# EAGLE design MotorProRePro (EAGLE 9.5.0)
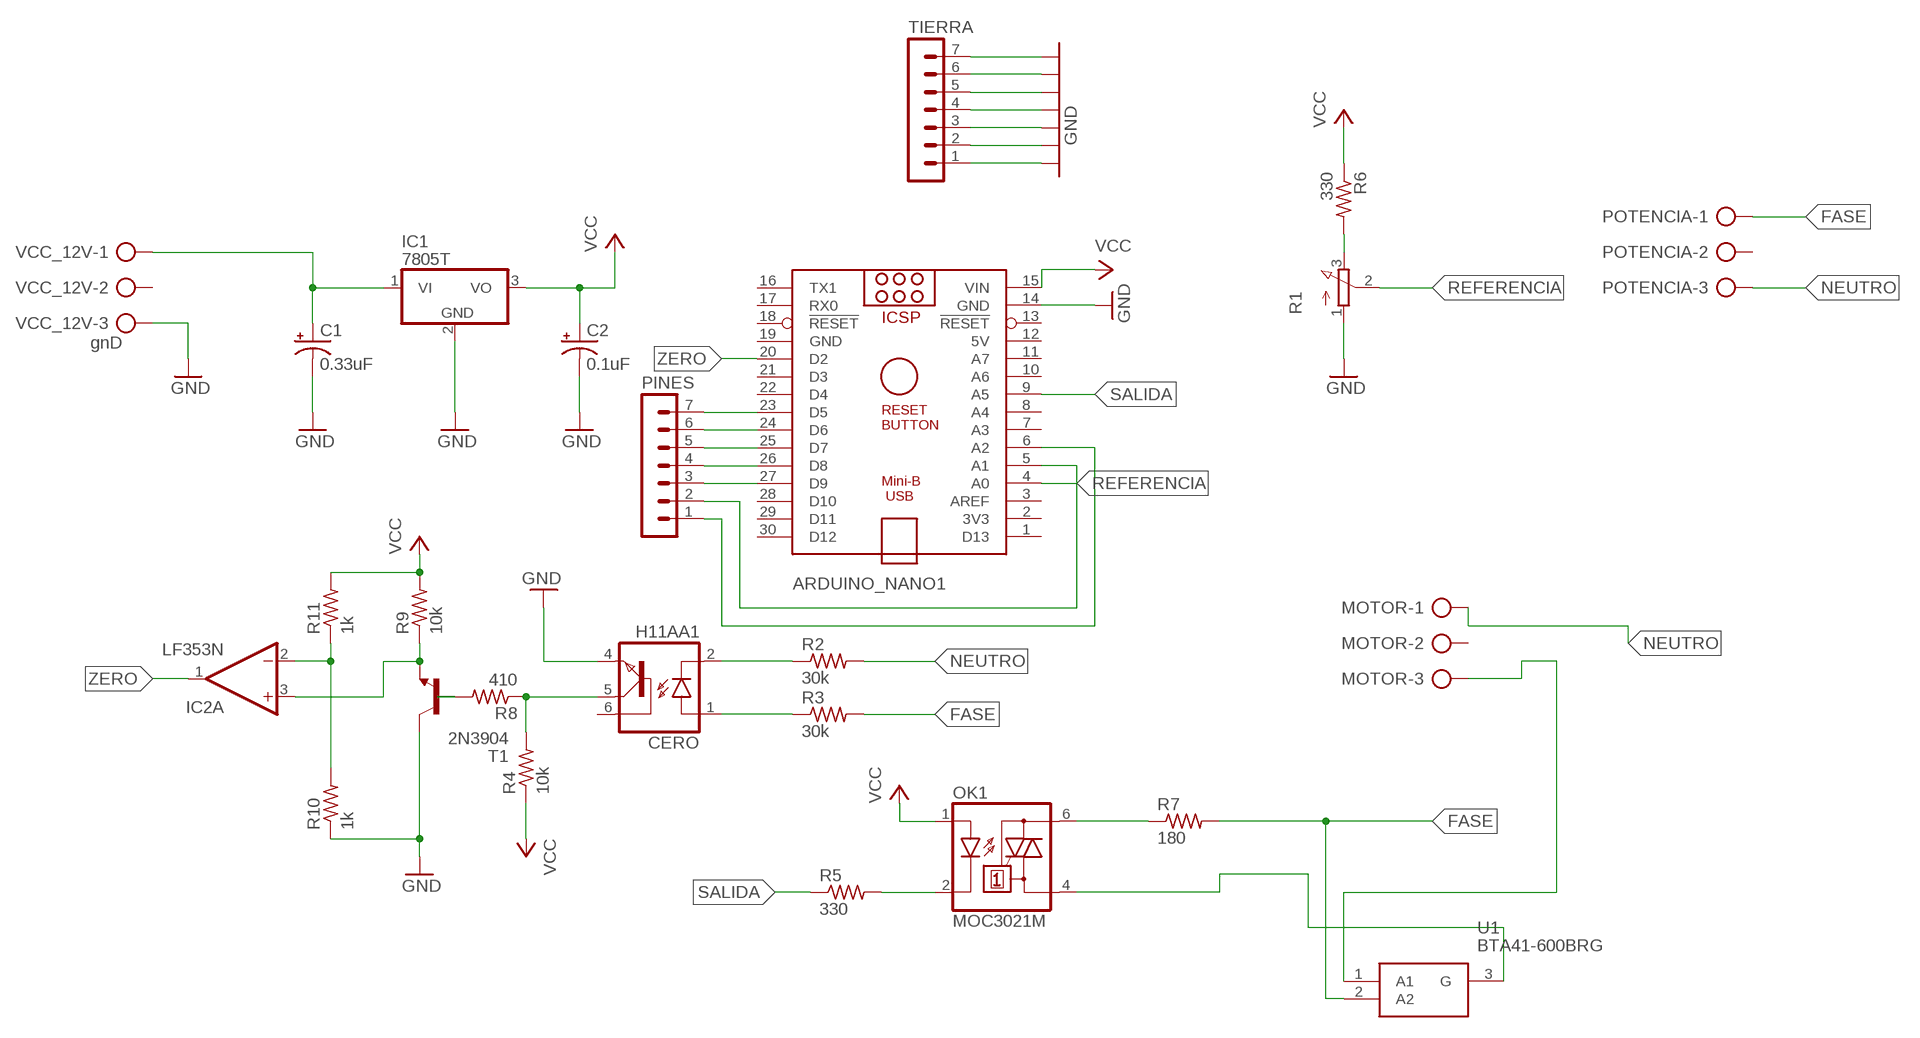
[diagram p0: schematic, sheet 1]

## Parts
ARDUINO_NANO1  ARDUINO_NANO  [ARDUINO_NANO]
C1  0.33uF  CPOL-USE5-6  [E5-6]
C2  0.1uF  CPOL-USE5-6  [E5-6]
CERO  H11AA1  H11A1M  [DIL06]
IC1  7805T  [TO220H]
IC2  LF353N  [DIL08]
MOTOR  AK500/3-H  [AK500/3-H]
OK1  MOC3021M  [DIL06]
PINES  MA07-1  [MA07-1]
POTENCIA  AK500/3-H  [AK500/3-H]
R1  3RP/1610N  [3RP/1610N]
R2  30k  R-US_0207/10  [0207/10]
R3  30k  R-US_0207/10  [0207/10]
R4  10k  R-US_0207/10  [0207/10]
R5  330  R-US_0207/10  [0207/10]
R6  330  R-US_0207/10  [0207/10]
R7  180  R-US_0207/10  [0207/10]
R8  410  R-US_0207/10  [0207/10]
R9  10k  R-US_0207/10  [0207/10]
R10  1k  R-US_0207/10  [0207/10]
R11  1k  R-US_0207/10  [0207/10]
T1  2N3904  [TO92]
TIERRA  MA07-1  [MA07-1]
U1  BTA41-600BRG  [TO552P460X1530X2985-3P]
VCC_12V  gnD  AK500/3-H  [AK500/3-H]

## Nets
FASE: POTENCIA.1 R3.2 R7.2 U1.2(A2)
GND: ARDUINO_NANO1.14(GND) C1.- C2.- CERO.4(EMI) IC1.2(GND) R1.1(A) R10.1 T1.1(C) TIERRA.1 TIERRA.2 TIERRA.3 TIERRA.4 TIERRA.5 TIERRA.6 TIERRA.7 VCC_12V.3
N$1: C1.+ IC1.1(VI) VCC_12V.1
N$2: CERO.2(C) R2.1
N$3: CERO.1(A) R3.1
N$4: OK1.2(C) R5.2
N$5: R1.3(E) R6.2
N$6: OK1.6(A2) R7.1
N$7: MOTOR.3 U1.1(A1)
N$8: OK1.4(A1) U1.3(G)
N$9: ARDUINO_NANO1.23(D5) PINES.7
N$10: ARDUINO_NANO1.24(D6) PINES.6
N$11: ARDUINO_NANO1.25(D7) PINES.5
N$12: ARDUINO_NANO1.26(D8) PINES.4
N$13: ARDUINO_NANO1.27(D9) PINES.3
N$14: ARDUINO_NANO1.5(A1) PINES.2
N$15: ARDUINO_NANO1.6(A2) PINES.1
N$16: R8.2 T1.2(B)
N$17: IC2.3(A:+IN) R9.1 T1.3(E)
N$18: IC2.2(A:-IN) R10.2 R11.1
NEUTRO: MOTOR.1 POTENCIA.3 R2.2
REFERENCIA: ARDUINO_NANO1.4(A0) R1.2(S)
SALIDA: ARDUINO_NANO1.9(A5) R5.1
VCC: ARDUINO_NANO1.15(VIN) C2.+ IC1.3(VO) OK1.1(A) R4.1 R6.1 R9.2 R11.2
ZERO: ARDUINO_NANO1.20(D2) CERO.5(COL) IC2.1(A:OUT) R4.2 R8.1
Unconnected: ARDUINO_NANO1.1(D13) ARDUINO_NANO1.2(3V3) ARDUINO_NANO1.3(AREF) ARDUINO_NANO1.7(A3) ARDUINO_NANO1.8(A4) ARDUINO_NANO1.10(A6) ARDUINO_NANO1.11(A7) ARDUINO_NANO1.13(!RESET) ARDUINO_NANO1.16(TX1) ARDUINO_NANO1.17(RX0) ARDUINO_NANO1.18(!RESET) ARDUINO_NANO1.21(D3) ARDUINO_NANO1.22(D4) ARDUINO_NANO1.28(D10) ARDUINO_NANO1.29(D11) ARDUINO_NANO1.30(D12) CERO.6(BAS) IC2.5(B:+IN) IC2.6(B:-IN) IC2.7(B:OUT) MOTOR.2 POTENCIA.2 VCC_12V.2

## Power pins joined to a net without a drawn wire
5V: ARDUINO_NANO1.12(5V)
GND: ARDUINO_NANO1.19(GND)
V+: IC2.8(P:V+)
V-: IC2.4(P:V-)

## Library data of the parts
ARDUINO_NANO1 = ArduinoNanoV30:ARDUINO_NANO: Arduino Nano V3.0 Overview: The Arduino Nano is a small, complete, and breadboard-friendly board based on the ATmega328 (Arduino Nano 3.x) or ATmega168 (Arduino Nano 2.x). It has more or less the same functionality of the Arduino Duemilanove, but in a different package. It lacks only a DC power jack, and works with a Mini-B USB cable instead of a standard one. The Nano was designed and is being produced by Gravitech. Specifications: Microcontroller Atmel ATmega168 or ATmega328 Operating Voltage (logic level) 5 V Input Voltage (recommended) 7-12 V Input Voltage (limits) 6-20 V Digital I/O Pins 14 (of which 6 provide PWM output) Analog Input Pins 8 DC Current per I/O Pin 40 mA Flash Memory 16 KB (ATmega168) or 32 KB (ATmega328) of which 2 KB used by bootloader SRAM 1 KB (ATmega168) or 2 KB (ATmega328) EEPROM 512 bytes (ATmega168) or 1 KB (ATmega328) Clock Speed 16 MHz Dimensions 0.73" x 1.70" Length 45 mm Width 18 mm Weigth 5 g Power: The Arduino Nano can be powered via the Mini-B USB connection, 6-20V unregulated external power supply (pin 30), or 5V regulated external power supply (pin 27). The power source is automatically selected to the highest voltage source. Memory: The ATmega168 has 16 KB of flash memory for storing code (of which 2 KB is used for the bootloader); the ATmega328 has 32 KB, (also with 2 KB used for the bootloader). The ATmega168 has 1 KB of SRAM and 512 bytes of EEPROM (which can be read and written with the EEPROM library); the ATmega328 has 2 KB of SRAM and 1 KB of EEPROM. Input and Output: Each of the 14 digital pins on the Nano can be used as an input or output, using pinMode(), digitalWrite(), and digitalRead() functions. They operate at 5 volts. Each pin can provide or receive a maximum of 40 mA and has an internal pull-up resistor (disconnected by default) of 20-50 kOhms. In addition, some pins have specialized functions. Visit Arduino - ArduinoBoardNano <https://www.arduino.cc/en/Main/ArduinoBoardNano>
C1 C2 = rcl:CPOL-US: POLARIZED CAPACITOR, American symbol; SPICEPREFIX: C
CERO = optocoupler:H11A*?M: General Purpose 6-Pin Phototransistor Optocouplers Source: http://www.fairchildsemi.com/ds/4N/4N35-M.pdf; MPN: H11A1-M; OC_FARNELL: 1021358; OC_NEWARK: 97K1793
IC1 = linear:78*: Positive VOLTAGE REGULATOR Source: http://cache.national.com/ds/LM/LM78L05.pdf http://www.fairchildsemi.com/ds/LM/LM7805.pdf
IC2 = linear:LF353: OP AMP
MOTOR POTENCIA VCC_12V = con-ptr500:AK500/3-H: CONNECTOR Aug. 2004 / PTR Meßtechnik: Die Bezeichnung der Serie AK505 wurde geändert. Es handelt sich hierbei um AK500 in horizontaler Ausführung.; OC_FARNELL: unknown; OC_NEWARK: unknown
OK1 = optocoupler:MOC30*M: RANDOM-PHASE OPTOISOLATORS TRIAC DRIVER OUTPUT Source: http://www.fairchildsemi.com MOC3020-M.pdf; MF: FAIRCHILD SEMICONDUCTOR; MPN: MOC3021-M; OC_FARNELL: 1021365; OC_NEWARK: 95B7895
PINES TIERRA = con-lstb:MA07-1: PIN HEADER; OC_FARNELL: unknown; OC_NEWARK: unknown
R1 = pot:3RP/1610N: 16mm Potentiometer one level Source: http://www.alphapotentiometers.net/html/16mm_pot_2.html
R2-R11 = rcl:R-US_: RESISTOR, American symbol; SPICEPREFIX: R
T1 = transistor:2N3904: NPN TRANSISTOR
U1 = BTA41-600BRG:BTA41-600BRG: TRIAC BTA41-600BRG, 600V, Gate Trigger 1.3V 100mA, TOP Insulated 3-Pin Source: Datasheet <http://uk.rs-online.com/web/p/products/6871007P>; ALLIED_NUMBER: 70332160; DESCRIPTION: TRIAC BTA41-600BRG, 600V, Gate Trigger 1.3V 100mA, TOP Insulated 3-Pin; HEIGHT: 4.6mm; MANUFACTURER_NAME: STMicroelectronics; MANUFACTURER_PART_NUMBER: BTA41-600BRG; RS_PART_NUMBER: 6871007P; RS_PRICE-STOCK: http://uk.rs-online.com/web/p/products/6871007P

## Board
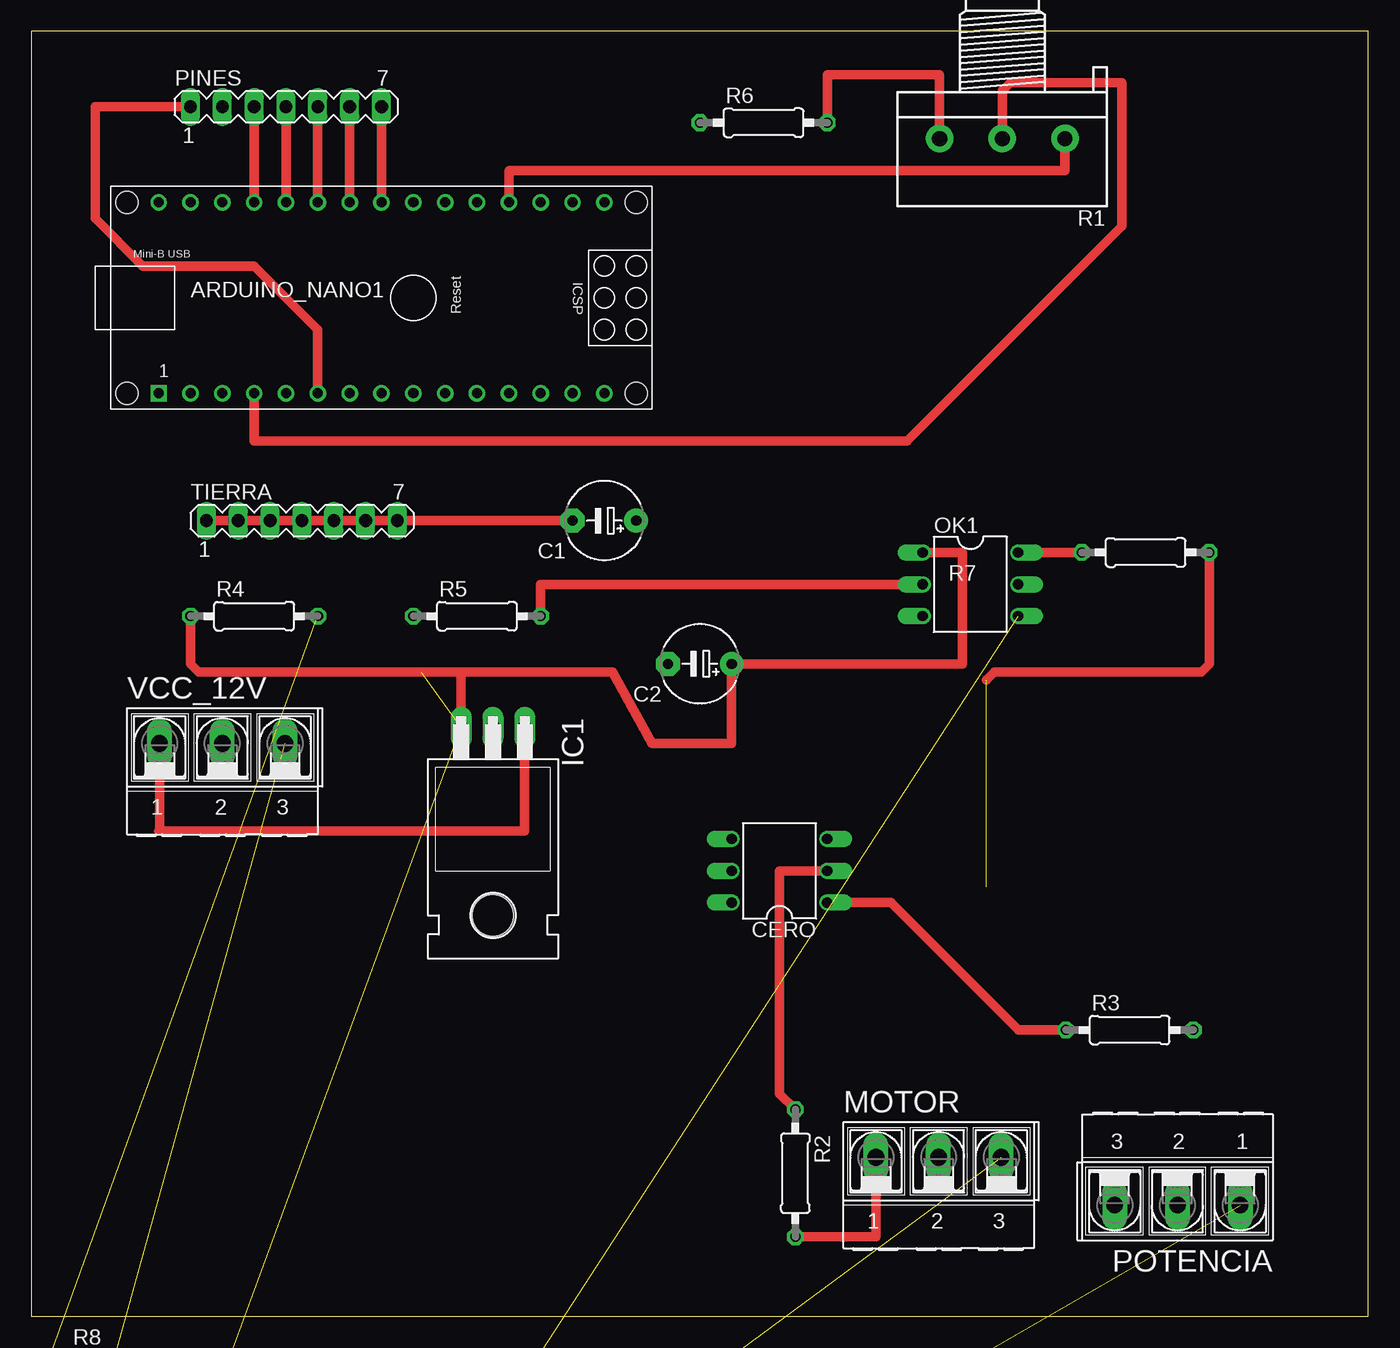
[diagram p1: board, top side]
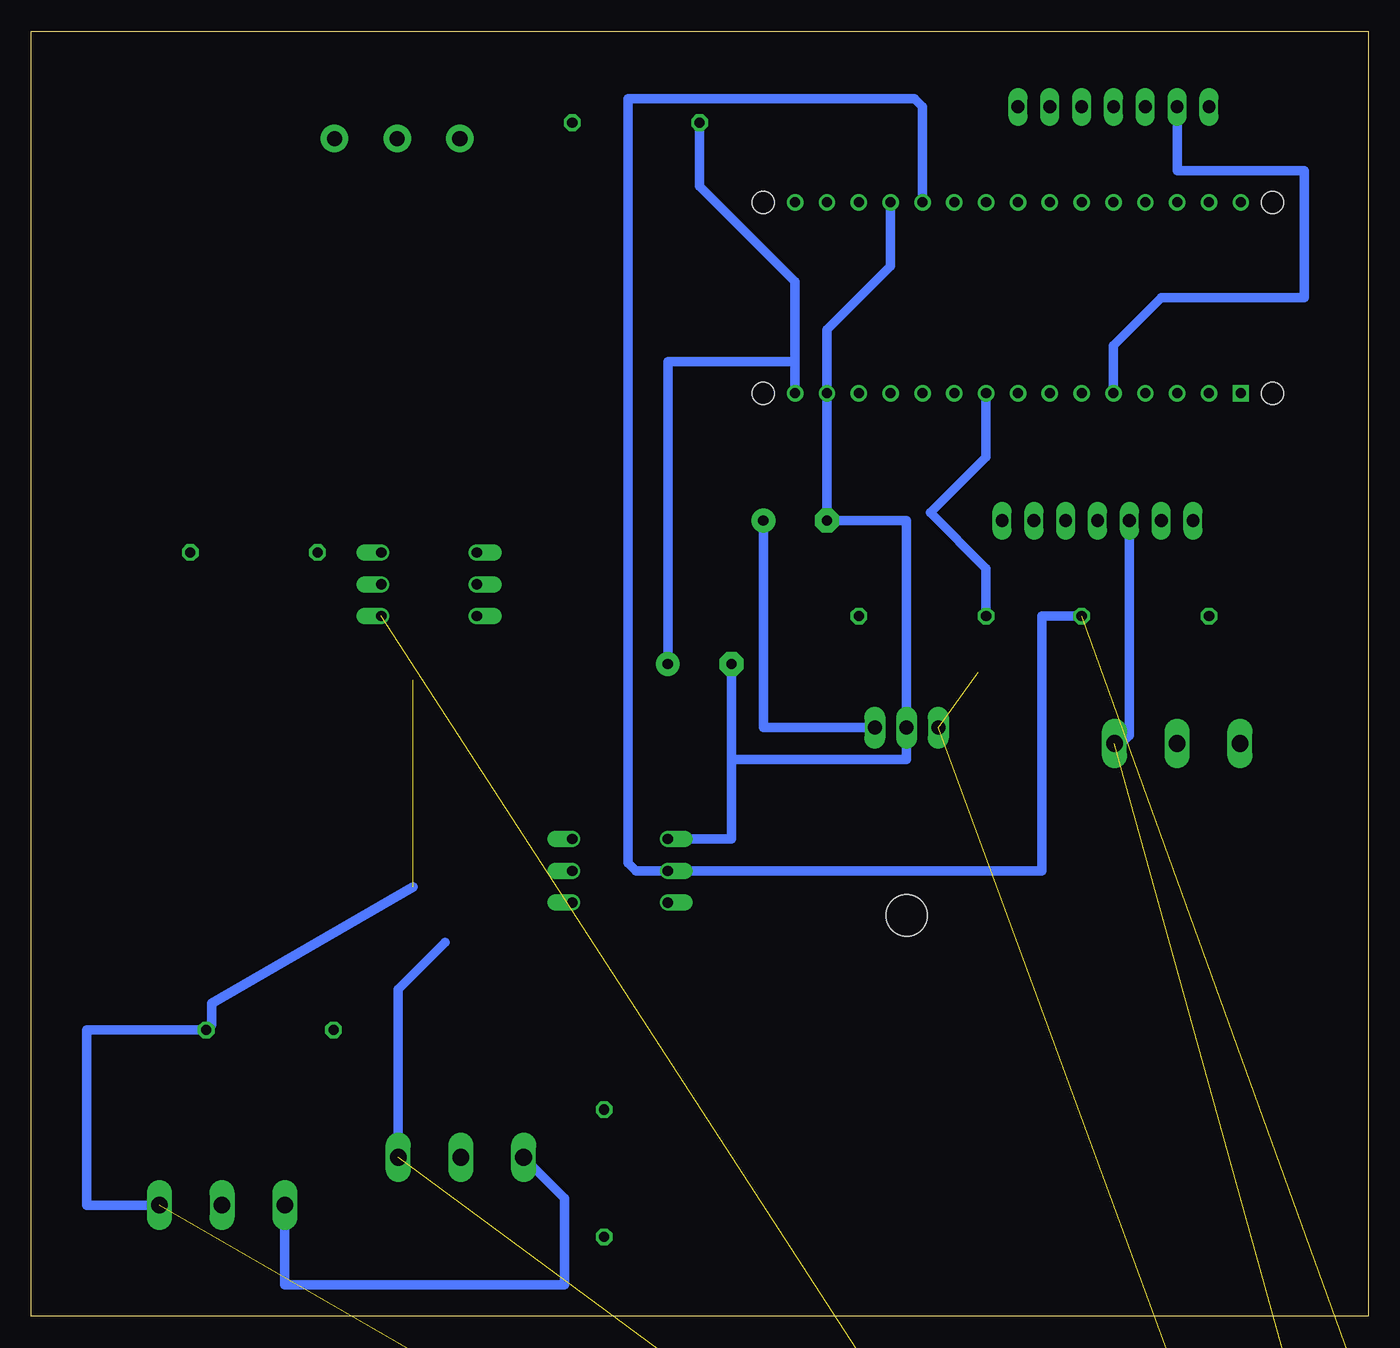
[diagram p2: board, bottom side, seen from below]

Size 106.66 x 102.54 mm. Coordinates in mm from the lower left corner, seen from the top.
Outline: 0,0 106.66,0 106.66,102.54 0,102.54 0,0
Copper layers (1*16): Top 0.035mm / dielectric 1.5mm / Bottom 0.035mm
Design rules "default *": minimum track width 30mil, minimum drill 0.35mm, track to track 15mil, track to pad 10mil, pad to pad 10mil, via to via 10mil, smd to smd 10mil, copper to edge 40mil, drill to drill 6mil, minimum pad ring 10mil, minimum via ring 8mil, stop-mask expansion 4mil, vias tented up to drill 0mil, thermal gap 10mil

### Footprints (pad centres in the part's own frame; a part is rotated, then mirrored left to right if it is on the bottom)
ARDUINO_NANO = drill 0.8 square: 1 -20.32,-7.62 | drill 0.8: 2 -17.78,-7.62; 3 -15.24,-7.62; 4 -12.7,-7.62; 5 -10.16,-7.62; 6 -7.62,-7.62; 7 -5.08,-7.62; 8 -2.54,-7.62; 9 0,-7.62; 10 2.54,-7.62; 11 5.08,-7.62; 12 7.62,-7.62; 13 10.16,-7.62; 14 12.7,-7.62; 15 15.24,-7.62; 16 15.24,7.62; 17 12.7,7.62; 18 10.16,7.62; 19 7.62,7.62; 20 5.08,7.62; 21 2.54,7.62; 22 0,7.62; 23 -2.54,7.62; 24 -5.08,7.62; 25 -7.62,7.62; 26 -10.16,7.62; 27 -12.7,7.62; 28 -15.24,7.62; 29 -17.78,7.62; 30 -20.32,7.62 | hole 1.778: -22.86,-7.62; -22.86,7.62; 17.78,7.62; 17.78,-7.62
E5-6 = drill 0.813 pad 1.905: + -2.54,0 | drill 0.813 pad 1.905 octagon: - 2.54,0
DIL06 = drill 0.813 offset: 1 -2.54,-3.81; 2 0,-3.81; 3 2.54,-3.81; 4 2.54,3.81; 5 0,3.81; 6 -2.54,3.81
TO220H = drill 1.118 long: 1 -2.54,-10.16; 2 0,-10.16; 3 2.54,-10.16 | hole 3.302: 0,4.826
DIL08 = drill 0.813 pad 1.27: 1 -3.81,-3.81; 2 -1.27,-3.81; 3 1.27,-3.81; 4 3.81,-3.81; 5 3.81,3.81; 6 1.27,3.81; 7 -1.27,3.81; 8 -3.81,3.81
AK500/3-H = drill 1.321 long: 1 -5.004,0; 2 0,0; 3 5.004,0
MA07-1 = drill 1.016 long: 1 -7.62,0; 2 -5.08,0; 3 -2.54,0; 4 0,0; 5 2.54,0; 6 5.08,0; 7 7.62,0
3RP/1610N = drill 1.2 pad 2.184: 1 -5,0; 2 0,0; 3 5,0
0207/10 = drill 0.813 octagon: 1 -5.08,0; 2 5.08,0
TO92 = drill 0.813 octagon: 1 1.27,0; 2 0,1.905; 3 -1.27,0
TO552P460X1530X2985-3P = drill 1.77 pad 2.655 square: 1 0,0 | drill 1.77 pad 2.655: 2 5.525,0; 3 11.05,0

### Placement (x,y rotation side)
ARDUINO_NANO1  30.48,81.28 0 top
C1  45.72,63.5 180 top
C2  53.34,52.07 180 top
CERO  59.69,35.56 90 top
IC1  36.83,36.83 180 top
IC2  7.62,-21.59 0 top  (outside the outline)
MOTOR  72.39,12.7 0 top
OK1  74.93,58.42 270 top
PINES  20.32,96.52 0 top
POTENCIA  91.44,8.89 180 top
R1  77.47,93.98 180 top
R2  60.96,11.43 270 top
R3  87.63,22.86 0 top
R4  17.78,55.88 0 top
R5  35.56,55.88 0 top
R6  58.42,95.25 0 top
R7  88.9,60.96 0 top
R8  6.35,-3.81 0 top  (outside the outline)
R9  6.35,-15.24 0 top  (outside the outline)
R10  6.35,-30.48 0 top  (outside the outline)
R11  6.35,-35.56 0 top  (outside the outline)
T1  3.81,-8.89 0 top  (outside the outline)
TIERRA  21.59,63.5 0 top
U1  5.08,-40.64 0 top  (outside the outline)
VCC_12V  15.24,45.72 0 top

### Tracks (layer width: path | path; a pad name or v marks a point on that pad's centre or on a via)
FASE  (2 unrouted)
  Top 0.762: R7.2 93.98,52.07 93.35,51.44 76.84,51.44 76.2,50.8
  Bottom 0.762: POTENCIA.1 102.23,8.89 102.23,22.86 R3.2 92.29,23.28 92.29,24.98 76.2,34.29
GND  (2 unrouted)
  Top 0.762: TIERRA.1 TIERRA.2 TIERRA.3 TIERRA.4 TIERRA.5 TIERRA.6 TIERRA.7 C1.- | R1.1 82.47,91.44 38.1,91.44 ARDUINO_NANO1.19
  Bottom 0.762: TIERRA.3 19.05,46.35 19.68,45.72 VCC_12V.3 | CERO.4 50.8,38.1 50.8,44.45 | C2.- 50.8,44.45 | ARDUINO_NANO1.19 38.1,83.82 43.18,78.74 ARDUINO_NANO1.14 C1.- 36.83,63.5 IC1.2 36.83,44.45 50.8,44.45
N$1
  Top 0.762: VCC_12V.1 10.24,38.81 10.16,38.73 39.37,38.73 IC1.1
  Bottom 0.762: IC1.1 48.26,46.99 C1.+
N$2
  Top 0.762: R2.1 59.69,17.78 59.69,35.56 CERO.2
N$3
  Top 0.762: CERO.1 68.58,33.02 78.74,22.86 R3.1
N$4
  Top 0.762: R5.2 40.64,58.42 OK1.2
N$5
  Top 0.762: R6.2 63.5,99.06 72.47,99.06 R1.3
N$6
  Top 0.762: R7.1 OK1.6
N$7  (1 unrouted)
  Bottom 0.762: MOTOR.3 77.39,26.11 73.66,29.84
N$8  (1 unrouted)
N$9
  Top 0.762: PINES.7 ARDUINO_NANO1.23
N$10
  Top 0.762: PINES.6 ARDUINO_NANO1.24
N$11
  Top 0.762: PINES.5 ARDUINO_NANO1.25
N$12
  Top 0.762: PINES.4 ARDUINO_NANO1.26
N$13
  Top 0.762: PINES.3 ARDUINO_NANO1.27
N$14
  Bottom 0.762: ARDUINO_NANO1.5 20.32,77.47 16.51,81.28 5.08,81.28 5.08,91.44 15.24,91.44 PINES.2
N$15
  Top 0.762: ARDUINO_NANO1.6 22.86,78.74 17.78,83.82 8.89,83.82 5.08,87.63 5.08,96.52 PINES.1
N$16  (1 unrouted)
N$17  (2 unrouted)
N$18  (2 unrouted)
NEUTRO
  Top 0.762: MOTOR.1 67.39,6.35 R2.2
  Bottom 0.762: POTENCIA.3 86.44,2.54 64.14,2.54 64.14,9.45 MOTOR.1
REFERENCIA
  Top 0.762: ARDUINO_NANO1.4 17.78,69.85 69.85,69.85 87,87 87,98.43 78.11,98.43 77.47,97.79 R1.2
SALIDA
  Bottom 0.762: ARDUINO_NANO1.9 30.48,68.58 34.92,64.14 30.48,59.69 R5.1
VCC  (3 unrouted)
  Top 0.762: OK1.1 74.3,60.96 74.3,52.07 C2.+ 55.88,45.72 49.53,45.72 46.35,51.44 31.11,51.44 | R4.1 12.7,52.07 13.34,51.44 34.29,51.44 IC1.3
  Bottom 0.762: 45.72,76.2 45.72,82.55 53.34,90.17 R6.1 | 45.72,76.2 ARDUINO_NANO1.15 | 45.72,76.2 55.88,76.2 C2.+
ZERO  (2 unrouted)
  Bottom 0.762: ARDUINO_NANO1.20 35.56,96.52 36.2,97.16 59.05,97.16 59.05,36.2 58.42,35.56 CERO.5 26.04,35.56 26.04,55.88 R4.2